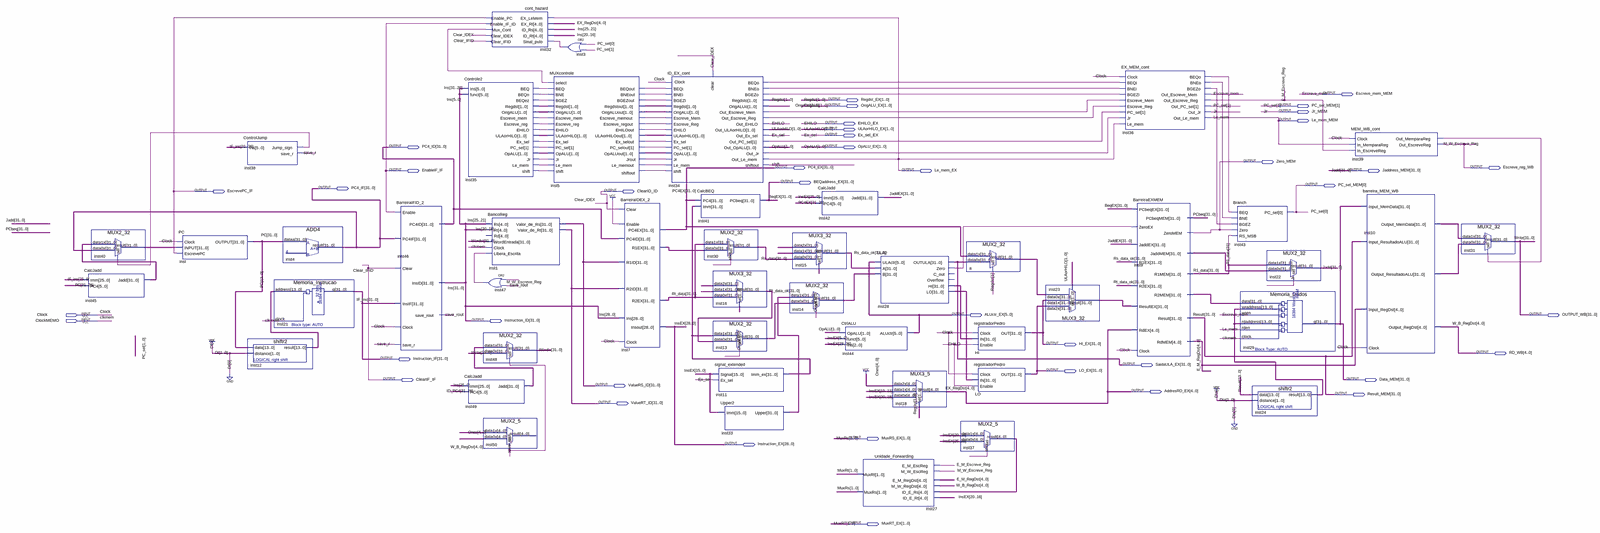
[diagram p0: schematic sheet, whole]
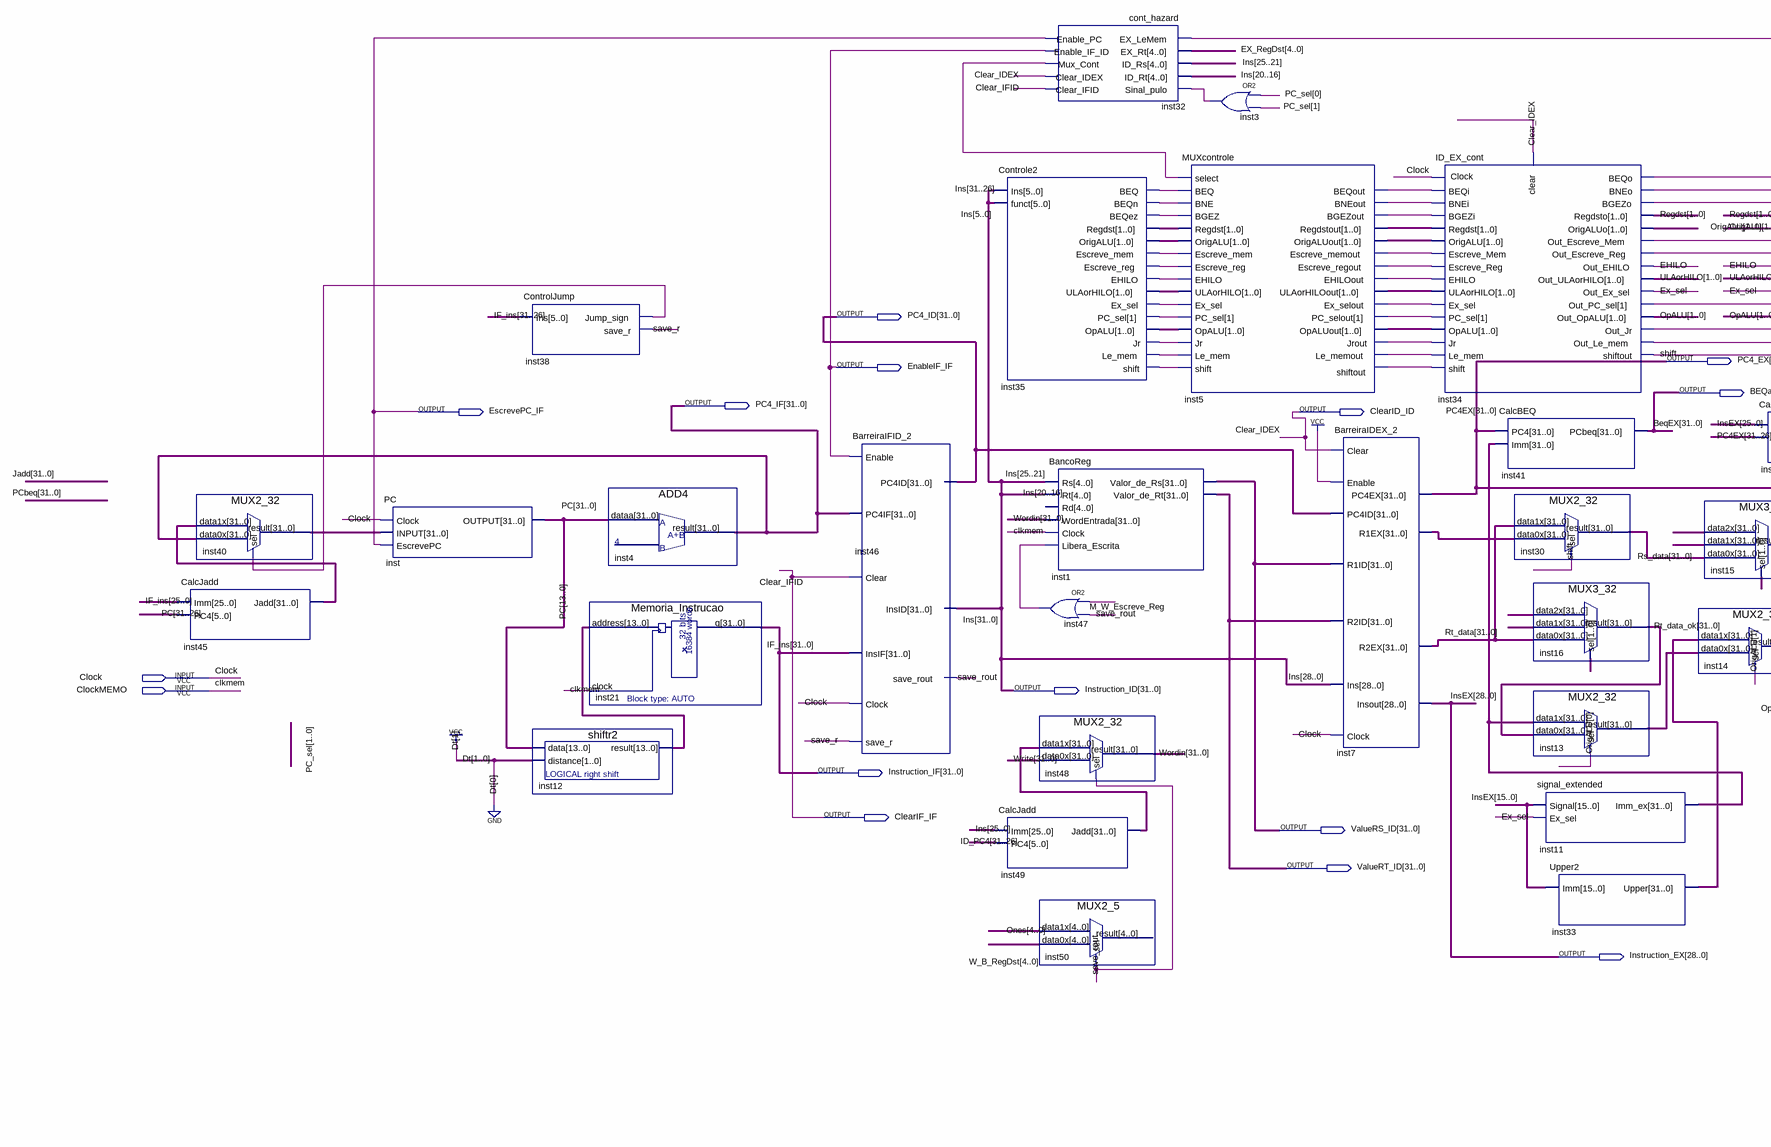
[diagram p1: schematic sheet, left part]
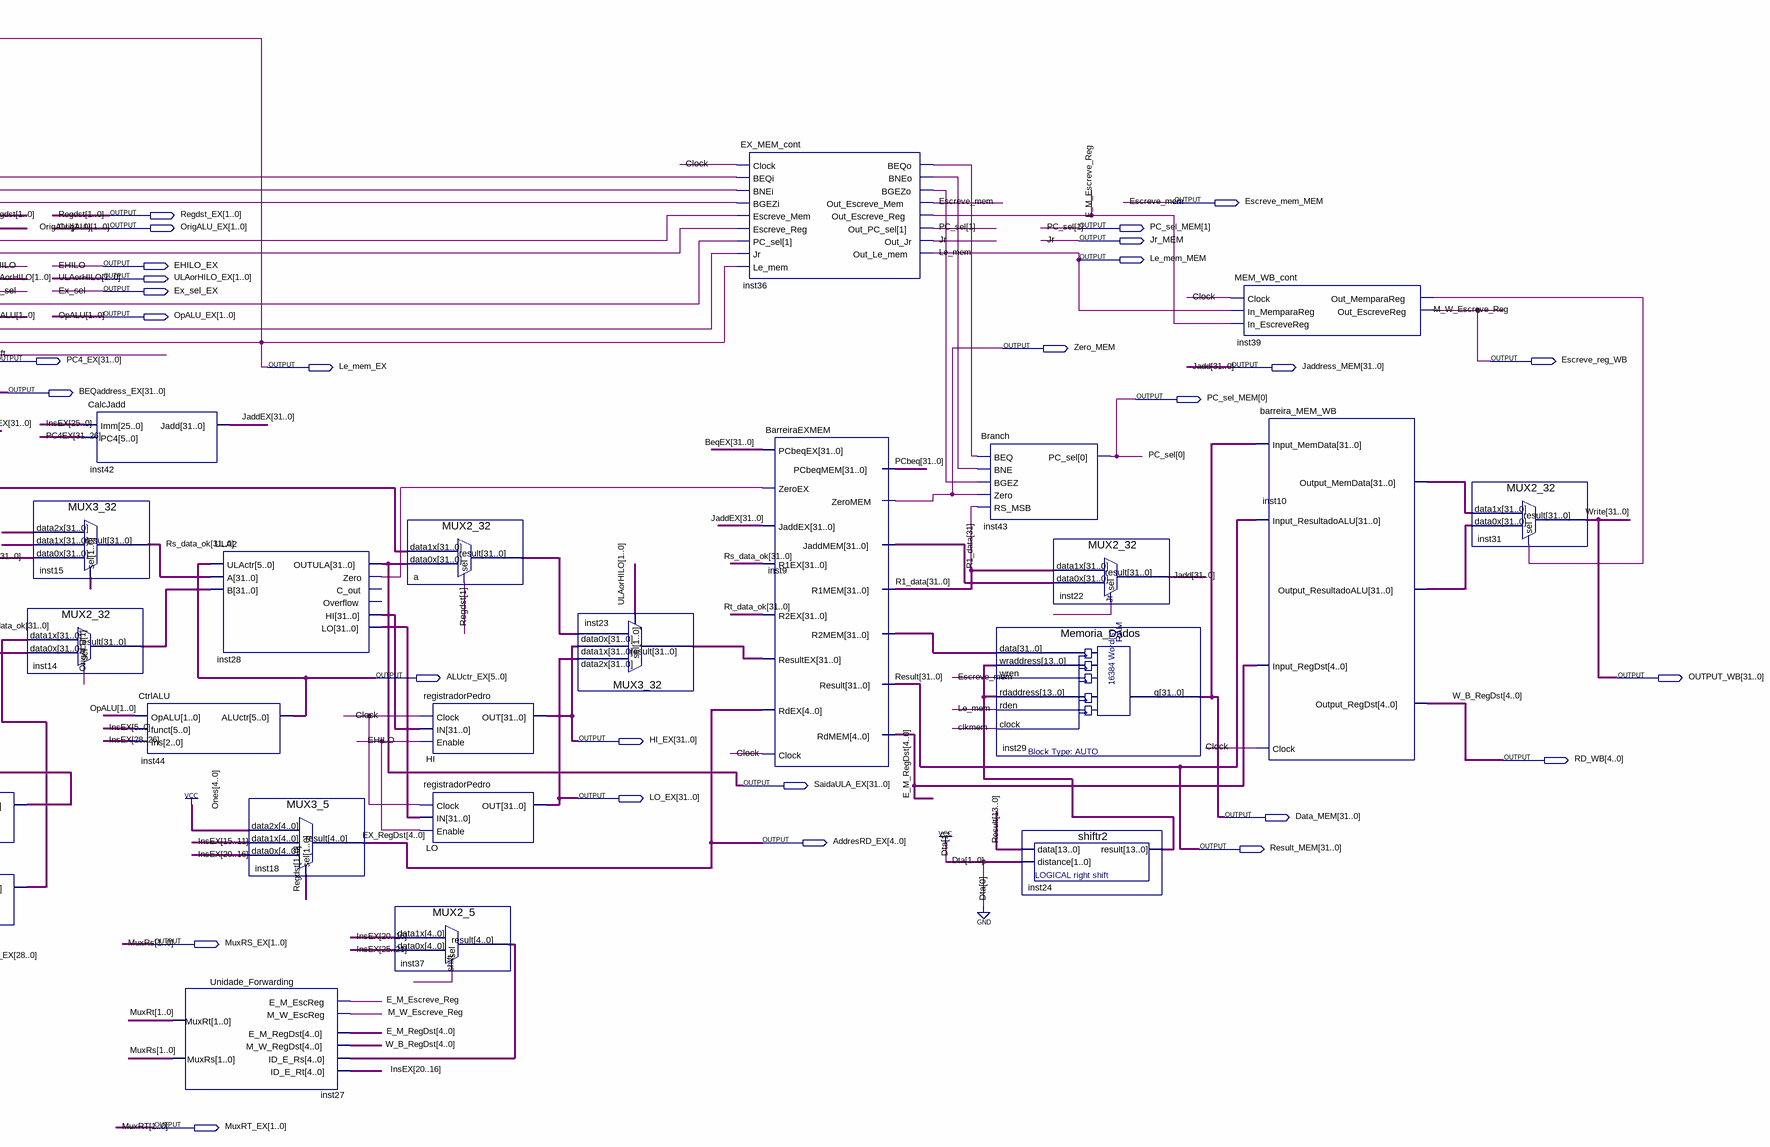
[diagram p2: schematic sheet, right part]
// Quartus schematic Pipelinecomjump.bdf as structural Verilog: 46 symbols, 41 pins
module Pipelinecomjump (
  input  Clock,
  input  ClockMEMO,
  output Escreve_mem_MEM,
  output [1:0] Regdst_EX,
  output [1:0] OrigALU_EX,
  output [1:0] PC_sel_MEM,
  output Jr_MEM,
  output Le_mem_MEM,
  output EHILO_EX,
  output [1:0] ULAorHILO_EX,
  output Ex_sel_EX,
  output [31:0] PC4_ID,
  output [1:0] OpALU_EX,
  output Zero_MEM,
  output [31:0] PC4_EX,
  output Escreve_reg_WB,
  output EnableIF_IF,
  output Le_mem_EX,
  output [31:0] Jaddress_MEM,
  output [31:0] BEQaddress_EX,
  output [31:0] PC4_IF,
  output EscrevePC_IF,
  output ClearID_ID,
  output [5:0] ALUctr_EX,
  output [31:0] OUTPUT_WB,
  output [31:0] Instruction_ID,
  output [31:0] HI_EX,
  output [4:0] RD_WB,
  output [31:0] Instruction_IF,
  output [31:0] SaidaULA_EX,
  output [31:0] LO_EX,
  output ClearIF_IF,
  output [31:0] Data_MEM,
  output [31:0] ValueRS_ID,
  output [4:0] AddresRD_EX,
  output [31:0] Result_MEM,
  output [31:0] ValueRT_ID,
  output [1:0] MuxRS_EX,
  output [28:0] Instruction_EX,
  output [1:0] MuxRT_EX
);

  wire E_M_Escreve_Reg, inst3_out, inst5_beqout, inst5_bgezout, inst5_bneout, inst5_ehiloout,
       inst5_escreve_memout, inst5_escreve_regout, inst5_ex_selout, inst5_jrout, inst5_le_memout,
       inst5_pc_selout, inst5_shiftout, inst28_zero, inst32_mux_cont, inst34_beqo, inst34_bgezo, inst34_bneo,
       inst34_out_escreve_mem, inst34_out_escreve_reg, inst34_out_jr, inst34_out_pc_sel, inst35_beq,
       inst35_beqez, inst35_beqn, inst35_ehilo, inst35_escreve_mem, inst35_escreve_reg, inst35_ex_sel,
       inst35_jr, inst35_le_mem, inst35_pc_sel, inst35_shift, inst36_beqo, inst36_bgezo, inst36_bneo,
       inst38_jump_sign, inst39_out_memparareg, inst47_out, save_r, save_rout, shift;
  wire [1:0] inst5_opaluout, inst5_origaluout, inst5_regdstout, inst5_ulaorhiloout, inst35_opalu,
       inst35_origalu, inst35_regdst, inst35_ulaorhilo;
  wire [4:0] E_M_RegDst, inst37_result;
  wire [13:0] inst12_result, inst24_result;
  wire [31:0] a_result, inst7_r1ex, inst9_jaddmem, inst9_r2mem, inst10_output_memdata,
       inst10_output_resultadoalu, inst11_imm_ex, inst13_result, inst14_result, inst23_result, inst28_hi,
       inst28_lo, inst33_upper, inst40_result, inst45_jadd, inst49_jadd, JaddEX, PC, PCbeq, R1_data, Rs_data,
       Rs_data_ok, Rt_data, Rt_data_ok, Wordin;
  wire [31:26] ID_PC4;

  MUX2_32 inst40 (.data1x(inst45_jadd), .data0x(PC4_IF), .sel(inst38_jump_sign), .result(inst40_result));
  CalcJadd inst45 (.Imm(Instruction_IF[25:0]), .PC4(PC[31:26]), .Jadd(inst45_jadd));
  PC inst (.EscrevePC(EscrevePC_IF), .Clock(Clock), .INPUT(inst40_result), .OUTPUT(PC));
  ControlJump inst38 (.Ins(Instruction_IF[31:26]), .Jump_sign(inst38_jump_sign), .save_r(save_r));
  shiftr2 inst12 (.data(PC[13:0]), .distance(2'b10), .result(inst12_result));
  ADD4 inst4 (.dataa(PC), .result(PC4_IF));
  Memoria_Instrucao inst21 (.address(inst12_result), .clock(ClockMEMO), .q(Instruction_IF));
  BarreiraIFID_2 inst46 (
    .Enable(EnableIF_IF), .PC4IF(PC4_IF), .Clear(ClearIF_IF), .InsIF(Instruction_IF), .Clock(Clock),
    .save_r(save_r), .PC4ID(PC4_ID), .InsID(Instruction_ID), .save_rout(save_rout));
  Controle2 inst35 (
    .Ins(Instruction_ID[31:26]), .funct(Instruction_ID[5:0]), .BEQ(inst35_beq), .BEQn(inst35_beqn),
    .BEQez(inst35_beqez), .Regdst(inst35_regdst), .OrigALU(inst35_origalu), .Escreve_mem(inst35_escreve_mem),
    .Escreve_reg(inst35_escreve_reg), .EHILO(inst35_ehilo), .ULAorHILO(inst35_ulaorhilo),
    .Ex_sel(inst35_ex_sel), .PC_sel(inst35_pc_sel), .OpALU(inst35_opalu), .Jr(inst35_jr),
    .Le_mem(inst35_le_mem), .shift(inst35_shift));
  CalcJadd inst49 (.Imm(Instruction_ID[25:0]), .PC4(ID_PC4), .Jadd(inst49_jadd));
  cont_hazard inst32 (
    .EX_LeMem(Le_mem_EX), .EX_Rt(AddresRD_EX), .ID_Rs(Instruction_ID[25:21]), .ID_Rt(Instruction_ID[20:16]),
    .Sinal_pulo(inst3_out), .Enable_PC(EscrevePC_IF), .Enable_IF_ID(EnableIF_IF), .Mux_Cont(inst32_mux_cont),
    .Clear_IDEX(ClearID_ID), .Clear_IFID(ClearIF_IF));
  BancoReg inst1 (
    .Rt(Instruction_ID[20:16]), .Rs(Instruction_ID[25:21]), .WordEntrada(Wordin), .Clock(ClockMEMO),
    .Libera_Escrita(inst47_out), .Valor_de_Rs(ValueRS_ID), .Valor_de_Rt(ValueRT_ID));  // open: Rd
  or inst47 (inst47_out, Escreve_reg_WB, save_rout);
  MUX2_32 inst48 (.data1x(inst49_jadd), .data0x(OUTPUT_WB), .sel(save_rout), .result(Wordin));
  MUX2_5 inst50 (.data1x({5{1'b1}}), .data0x(RD_WB), .sel(save_rout));  // open: result
  MUXcontrole inst5 (
    .select(inst32_mux_cont), .BEQ(inst35_beq), .BNE(inst35_beqn), .BGEZ(inst35_beqez),
    .Regdst(inst35_regdst), .OrigALU(inst35_origalu), .Escreve_mem(inst35_escreve_mem),
    .Escreve_reg(inst35_escreve_reg), .EHILO(inst35_ehilo), .ULAorHILO(inst35_ulaorhilo),
    .Ex_sel(inst35_ex_sel), .PC_sel(inst35_pc_sel), .OpALU(inst35_opalu), .Jr(inst35_jr),
    .Le_mem(inst35_le_mem), .shift(inst35_shift), .BEQout(inst5_beqout), .BNEout(inst5_bneout),
    .BGEZout(inst5_bgezout), .Regdstout(inst5_regdstout), .OrigALUout(inst5_origaluout),
    .Escreve_memout(inst5_escreve_memout), .Escreve_regout(inst5_escreve_regout), .EHILOout(inst5_ehiloout),
    .ULAorHILOout(inst5_ulaorhiloout), .Ex_selout(inst5_ex_selout), .PC_selout(inst5_pc_selout),
    .OpALUout(inst5_opaluout), .Jrout(inst5_jrout), .Le_memout(inst5_le_memout), .shiftout(inst5_shiftout));
  or inst3 (inst3_out, PC_sel_MEM[0], PC_sel_MEM[1]);
  BarreiraIDEX_2 inst7 (
    .Clear(ClearID_ID), .Enable(1'b1), .PC4ID(PC4_ID), .R1ID(ValueRS_ID), .R2ID(ValueRT_ID),
    .Ins(Instruction_ID[28:0]), .Clock(Clock), .PC4EX(PC4_EX), .R1EX(inst7_r1ex), .R2EX(Rt_data),
    .Insout(Instruction_EX));
  ID_EX_cont inst34 (
    .clear(ClearID_ID), .Clock(Clock), .BEQi(inst5_beqout), .BNEi(inst5_bneout), .BGEZi(inst5_bgezout),
    .Regdst(inst5_regdstout), .OrigALU(inst5_origaluout), .Escreve_Mem(inst5_escreve_memout),
    .Escreve_Reg(inst5_escreve_regout), .EHILO(inst5_ehiloout), .ULAorHILO(inst5_ulaorhiloout),
    .Ex_sel(inst5_ex_selout), .PC_sel(inst5_pc_selout), .OpALU(inst5_opaluout), .Jr(inst5_jrout),
    .Le_mem(inst5_le_memout), .shift(inst5_shiftout), .BEQo(inst34_beqo), .BNEo(inst34_bneo),
    .BGEZo(inst34_bgezo), .Regdsto(Regdst_EX), .OrigALUo(OrigALU_EX),
    .Out_Escreve_Mem(inst34_out_escreve_mem), .Out_Escreve_Reg(inst34_out_escreve_reg), .Out_EHILO(EHILO_EX),
    .Out_ULAorHILO(ULAorHILO_EX), .Out_Ex_sel(Ex_sel_EX), .Out_PC_sel(inst34_out_pc_sel),
    .Out_OpALU(OpALU_EX), .Out_Jr(inst34_out_jr), .Out_Le_mem(Le_mem_EX), .shiftout(shift));
  CalcBEQ inst41 (.PC4(PC4_EX), .Imm(inst11_imm_ex), .PCbeq(BEQaddress_EX));
  MUX2_32 inst30 (.data1x(Rt_data), .data0x(inst7_r1ex), .sel(shift), .result(Rs_data));
  MUX3_32 inst16 (.data2x(Result_MEM), .data1x(OUTPUT_WB), .data0x(Rt_data), .sel(MuxRT_EX), .result(Rt_data_ok));
  MUX2_32 inst13 (.data1x(inst11_imm_ex), .data0x(Rt_data_ok), .sel(OrigALU_EX[0]), .result(inst13_result));
  signal_extended inst11 (.Signal(Instruction_EX[15:0]), .Ex_sel(Ex_sel_EX), .Imm_ex(inst11_imm_ex));
  Upper2 inst33 (.Imm(Instruction_EX[15:0]), .Upper(inst33_upper));
  MUX3_32 inst15 (.data2x(Result_MEM), .data1x(OUTPUT_WB), .data0x(Rs_data), .sel(MuxRS_EX), .result(Rs_data_ok));
  MUX2_32 inst14 (.data1x(inst33_upper), .data0x(inst13_result), .sel(OrigALU_EX[1]), .result(inst14_result));
  CalcJadd inst42 (.Imm(Instruction_EX[25:0]), .PC4(PC4_EX[31:26]), .Jadd(JaddEX));
  CtrlALU inst44 (.OpALU(OpALU_EX), .funct(Instruction_EX[5:0]), .Ins(Instruction_EX[28:26]), .ALUctr(ALUctr_EX));
  ULA2 inst28 (
    .ULActr(ALUctr_EX), .A(Rs_data_ok), .B(inst14_result), .OUTULA(SaidaULA_EX), .Zero(inst28_zero),
    .HI(inst28_hi), .LO(inst28_lo));  // open: C_out, Overflow
  Unidade_Forwarding inst27 (
    .E_M_EscReg(E_M_Escreve_Reg), .M_W_EscReg(Escreve_reg_WB), .E_M_RegDst(E_M_RegDst), .M_W_RegDst(RD_WB),
    .ID_E_Rs(inst37_result), .ID_E_Rt(Instruction_EX[20:16]), .MuxRt(MuxRT_EX), .MuxRs(MuxRS_EX));
  MUX3_5 inst18 (
    .data2x({5{1'b1}}), .data1x(Instruction_EX[15:11]), .data0x(Instruction_EX[20:16]), .sel(Regdst_EX),
    .result(AddresRD_EX));
  MUX2_32 a (.data1x(PC4_EX), .data0x(SaidaULA_EX), .sel(Regdst_EX[1]), .result(a_result));
  registradorPedro HI (.Clock(Clock), .IN(inst28_hi), .Enable(EHILO_EX), .OUT(HI_EX));
  registradorPedro LO (.Clock(Clock), .IN(inst28_lo), .Enable(EHILO_EX), .OUT(LO_EX));
  MUX2_5 inst37 (.data1x(Instruction_EX[20:16]), .data0x(Instruction_EX[25:21]), .sel(shift), .result(inst37_result));
  MUX3_32 inst23 (.data2x(LO_EX), .data1x(HI_EX), .data0x(a_result), .sel(ULAorHILO_EX), .result(inst23_result));
  EX_MEM_cont inst36 (
    .Clock(Clock), .BEQi(inst34_beqo), .BNEi(inst34_bneo), .BGEZi(inst34_bgezo),
    .Escreve_Mem(inst34_out_escreve_mem), .Escreve_Reg(inst34_out_escreve_reg), .PC_sel(inst34_out_pc_sel),
    .Jr(inst34_out_jr), .Le_mem(Le_mem_EX), .BEQo(inst36_beqo), .BNEo(inst36_bneo), .BGEZo(inst36_bgezo),
    .Out_Escreve_Mem(Escreve_mem_MEM), .Out_Escreve_Reg(E_M_Escreve_Reg), .Out_PC_sel(PC_sel_MEM[1]),
    .Out_Jr(Jr_MEM), .Out_Le_mem(Le_mem_MEM));
  BarreiraEXMEM inst9 (
    .PCbeqEX(BEQaddress_EX), .ZeroEX(inst28_zero), .JaddEX(JaddEX), .R1EX(Rs_data_ok), .Clock(Clock),
    .R2EX(Rt_data_ok), .ResultEX(inst23_result), .RdEX(AddresRD_EX), .PCbeqMEM(PCbeq), .ZeroMEM(Zero_MEM),
    .JaddMEM(inst9_jaddmem), .R1MEM(R1_data), .R2MEM(inst9_r2mem), .Result(Result_MEM), .RdMEM(E_M_RegDst));
  Branch inst43 (
    .BEQ(inst36_beqo), .BNE(inst36_bneo), .BGEZ(inst36_bgezo), .Zero(Zero_MEM), .RS_MSB(R1_data[31]),
    .PC_sel(PC_sel_MEM[0]));
  Memoria_Dados inst29 (
    .data(inst9_r2mem), .wraddress(inst24_result), .wren(Escreve_mem_MEM), .rdaddress(inst24_result),
    .rden(Le_mem_MEM), .clock(ClockMEMO), .q(Data_MEM));
  shiftr2 inst24 (.data(Result_MEM[13:0]), .distance(2'b10), .result(inst24_result));
  MUX2_32 inst22 (.data1x(R1_data), .data0x(inst9_jaddmem), .sel(Jr_MEM), .result(Jaddress_MEM));
  MEM_WB_cont inst39 (
    .Clock(Clock), .In_MemparaReg(Le_mem_MEM), .In_EscreveReg(E_M_Escreve_Reg),
    .Out_MemparaReg(inst39_out_memparareg), .Out_EscreveReg(Escreve_reg_WB));
  barreira_MEM_WB inst10 (
    .Clock(Clock), .Input_MemData(Data_MEM), .Input_ResultadoALU(Result_MEM), .Input_RegDst(E_M_RegDst),
    .Output_MemData(inst10_output_memdata), .Output_ResultadoALU(inst10_output_resultadoalu),
    .Output_RegDst(RD_WB));
  MUX2_32 inst31 (
    .data1x(inst10_output_memdata), .data0x(inst10_output_resultadoalu), .sel(inst39_out_memparareg),
    .result(OUTPUT_WB));

  // Other names for the same wires on the sheet: EX_RegDst[4:0] = AddresRD_EX; BeqEX[31:0] = BEQaddress_EX;
  //   Clear_IDEX = ClearID_ID; Clear_IFID = ClearIF_IF; clkmem = ClockMEMO; EHILO = EHILO_EX;
  //   Escreve_mem = Escreve_mem_MEM; Ex_sel = Ex_sel_EX; IF_ins[31:0] = Instruction_IF; Ins[31:0] = Instruction_ID;
  //   InsEX[28:0] = Instruction_EX; Jadd[31:0] = Jaddress_MEM; Jr = Jr_MEM; Le_mem = Le_mem_MEM;
  //   M_W_Escreve_Reg = Escreve_reg_WB; MuxRs[1:0] = MuxRS_EX; MuxRt[1:0] = MuxRT_EX; OpALU[1:0] = OpALU_EX;
  //   OrigALU[1:0] = OrigALU_EX; Write[31:0] = OUTPUT_WB; PC4EX[31:0] = PC4_EX; PC_sel[1:0] = PC_sel_MEM;
  //   W_B_RegDst[4:0] = RD_WB; Regdst[1:0] = Regdst_EX; Result[31:0] = Result_MEM; ULAorHILO[1:0] = ULAorHILO_EX
endmodule
